# EAGLE design PPG AFE first revision (EAGLE 7.6.0)
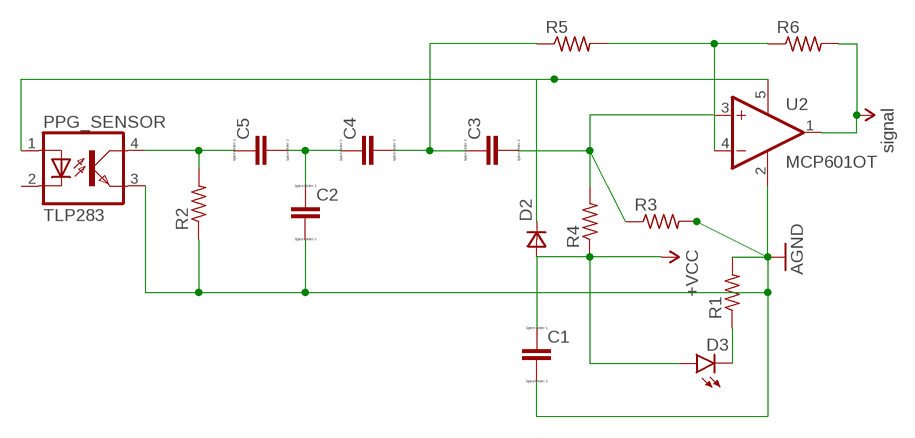
[diagram p0: schematic, sheet 1]

## Parts
C1  CC0201  [C0201]
C2  CC0201  [C0201]
C3  CC0201  [C0201]
C4  CC0201  [C0201]
C5  CC0201  [C0201]
D2  DSOD323  [SOD323]
D3  LED-FKIT-1206  [FKIT-LED-1206]
PPG_SENSOR  TLP283  [MINI-FLAT-4]
R1  R-US_R0603  [R0603]
R2  R-US_R0603  [R0603]
R3  R-US_R0603  [R0603]
R4  R-US_R0603  [R0603]
R5  R-US_R0603  [R0603]
R6  R-US_R0603  [R0603]
U2  MCP601OT  [SOT23-5]

## Nets
AGND: C1.2 C2.2 PPG_SENSOR.3(EMIT) R1.2 R2.1 R3.2 U2.2(V-)
N$1: C3.2 R3.1 R4.2 U2.3(+IN)
N$2: R5.2 R6.1 U2.4(-IN)
N$3: D2.1(C) PPG_SENSOR.1(A) U2.5(V+)
N$4: C3.1 C4.2 R5.1
N$6: C2.1 C4.1 C5.2
N$8: C5.1 PPG_SENSOR.4(COL) R2.2
N$9: D3.C R1.1
VCC: C1.1 D2.2(A) D3.A R4.1 ; supply symbol labelled +VCC
VCC_1: R6.2 U2.1(OUT) ; supply symbol labelled signal
Unconnected: PPG_SENSOR.2(C)

## Library data of the parts
C1-C5 = eagle-ltspice:C: CAPACITOR, European symbol; SPICEMODEL: NONE; SPICEPREFIX: C
D2 = zetex:D: DIODE; MPN: CDSOD323-T05C; OC_FARNELL: 1824860; OC_NEWARK: 79R6078
D3 = SparkFun-LED:LED: LEDs Standard schematic elements and footprints for 5mm, 3mm, 1206, and 0603 sized LEDs. 5mm - Spark Fun Electronics SKU : COM-00529 (and others)
PPG_SENSOR = optocoupler:TLP283: TOSHIBA PHOTOCOUPLER GaAs IRED & PHOTO-TRANSISTOR Source: http://www.semicon.toshiba.co.jp/td/en/Opto/Photocoupler/en_20050928_TLP283_datasheet.pdf; OC_FARNELL: unknown; OC_NEWARK: unknown
R1-R6 = rcl:R-US_: RESISTOR, American symbol
U2 = linear:MCP601: Single Op Amp 2.7V to 6.0V Single Supply CMOS Source: http://ww1.microchip.com/downloads/en/DeviceDoc/21314g.pdf

## Board
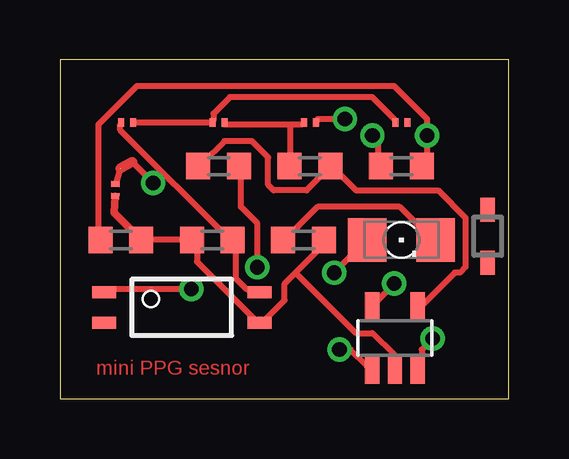
[diagram p1: board, top side]
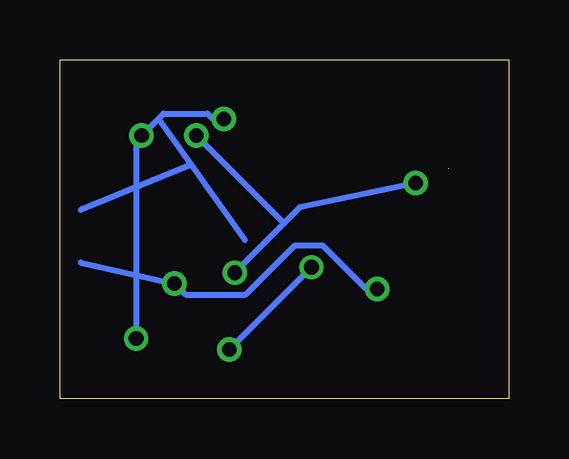
[diagram p2: board, bottom side, seen from below]

Size 18.72 x 14.12 mm. Coordinates in mm from the lower left corner, seen from the top.
Outline: 0,0 18.72,0 18.72,14.12 0,14.12 0,0
Copper layers (1*16): Top 0.035mm / dielectric 1.5mm / Bottom 0.035mm
Design rules "default": minimum track width 10mil, minimum drill 24mil, track to track 8mil, track to pad 8mil, pad to pad 8mil, via to via 8mil, smd to smd 8mil, copper to edge 40mil, drill to drill 8mil, minimum pad ring 10mil, minimum via ring 8mil, stop-mask expansion 4mil, vias tented up to drill 0mil, thermal gap 10mil

### Footprints (pad centres in the part's own frame; a part is rotated, then mirrored left to right if it is on the bottom)
C0201 = smd 0.25 x 0.35: 1 -0.25,0; 2 0.25,0
SOD323 = smd 1 x 0.6: 1 -1.1,0; 2 1.1,0
FKIT-LED-1206 = smd 1.6 x 1.803: A -1.422,0; C 1.422,0
MINI-FLAT-4 = smd 1 x 0.5: 1 -3.24,0.635; 2 -3.24,-0.635; 3 3.24,-0.635; 4 3.24,0.635
R0603 = smd 1 x 1.1: 1 -0.85,0; 2 0.85,0
SOT23-5 = smd 0.6 x 1.2: 1 -0.95,-1.306; 2 0,-1.306; 3 0.95,-1.306; 4 0.95,1.306; 5 -0.95,1.306

### Placement (x,y rotation side)
C1  2.31,8.7 268.6 top
C2  14.24,11.51 0 top
C3  10.43,11.51 0 top
C4  6.62,11.51 0 top
C5  2.81,11.51 0 top
D2  17.84,6.78 90 top
D3  14.24,6.62 0 top
PPG_SENSOR  5.08,3.81 0 top
R1  10.16,6.62 0 top
R2  6.35,6.62 0 top
R3  2.54,6.62 0 top
R4  14.24,9.7 0 top
R5  10.43,9.7 0 top
R6  6.62,9.7 0 top
U2  13.97,2.54 0 top

### Tracks (layer width: path | path; a pad name or v marks a point on that pad's centre or on a via)
AGND
  Top 0.254: R3.2 3.43,6.63 5.49,6.63 R2.1 5.71,6.4 5.71,5.71 8.23,3.2 PPG_SENSOR.3 8.46,3.2 9.37,4.12 9.37,4.8 9.83,5.26 | 9.83,5.26 10.97,6.4 R1.2 | 9.83,5.26 12.34,2.74 13.03,2.74 13.95,1.83 13.95,1.37 U2.2
  Top 0.305: C1.2 2.25,7.76 R3.2
  Bottom 0.254: R1.2 C2.2
N$1  (via drill 0.61)
  Top 0.254: v11.89,11.66 10.74,11.66 C3.2 | R4.2 15.32,9.83 v15.32,10.97 15.32,11.66 13.95,13.03 3.2,13.03 1.6,11.43 1.6,6.63 R3.1 | v15.54,2.52 15.09,2.06 15.09,1.37 U2.3
  Bottom 0.254: v11.89,11.66 12.34,11.66 12.57,11.89 14.4,11.89 v15.32,10.97 15.54,10.74 v15.54,2.52
N$2
  Top 0.254: R6.1 5.94,9.83 6.86,10.74 8,10.74 8.69,10.06 8.69,8.91 8.91,8.69 10.29,8.69 11.2,9.6 R5.2 11.43,9.6 12.34,8.69 15.77,8.69 16.92,7.54 16.92,5.49 16.69,5.26 16.46,5.26 15.09,3.89 U2.4
N$3  (via drill 0.61)
  Top 0.254: v5.49,4.57 2.06,4.57 PPG_SENSOR.1 | v13.95,4.8 13.03,3.89 U2.5
  Bottom 0.254: v5.49,4.57 5.94,4.57 7.77,6.4 8.91,6.4 10.97,4.34 13.49,4.34 v13.95,4.8 D2.1
N$4
  Top 0.254: 9.6,11.43 10.06,11.43 C3.1 | 9.6,11.43 6.86,11.43 C4.2 | 9.6,11.43 9.6,9.83 R5.1
N$6
  Top 0.254: C2.1 13.95,11.66 13.03,12.57 7.09,12.57 6.4,11.89 6.4,11.66 C4.1 C5.2
N$8
  Top 0.254: C5.1 2.52,11.43 2.52,11.2 7.09,6.63 R2.2 7.32,6.4 7.32,5.03 7.77,4.57 8.23,4.57 PPG_SENSOR.4
N$9
  Top 0.254: R1.1 9.37,6.63 10.74,8 14.17,8 15.54,6.63 D3.C
VCC  (via drill 0.61)  (1 unrouted)
  Top 0.254: v11.43,5.26 12.8,6.63 D3.A | v13.03,10.97 13.26,10.74 13.26,9.83 R4.1 | 3.02,9.87 v3.89,9 | 2.52,9.59 C1.1
  Top 0.406: 2.52,9.6 3.02,9.87
  Bottom 0.254: v3.89,9 8.69,8 9.37,7.32 | v11.43,5.26 9.37,7.32 | 9.37,7.32 v13.03,10.97 | R4.1 D2.2
VCC_1  (via drill 0.61)
  Top 0.254: v8.23,5.49 8.23,7.32 7.54,8 7.54,9.6 R6.2 | v11.66,2.06 12.12,2.06 12.8,1.37 U2.1
  Bottom 0.254: v11.66,2.06 v8.23,5.49

### Text on the board
Top: mini PPG sesnor